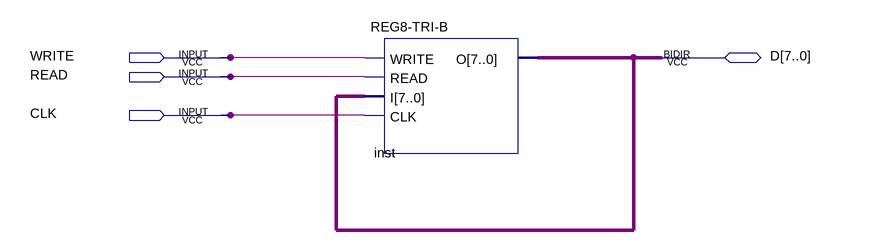
[diagram p0: schematic sheet]
// Quartus schematic REG7-TRI-B-IO.bdf as structural Verilog: 1 symbols, 4 pins
module \REG7-TRI-B-IO  (
  input  WRITE,
  input  READ,
  input  CLK,
  inout  [7:0] D
);

  \REG8-TRI-B  inst (.WRITE(WRITE), .READ(READ), .I(D), .CLK(CLK), .O(D));
endmodule
